# Altium schematic sheet 09 NAND.SchDoc
size 420 x 297 mm
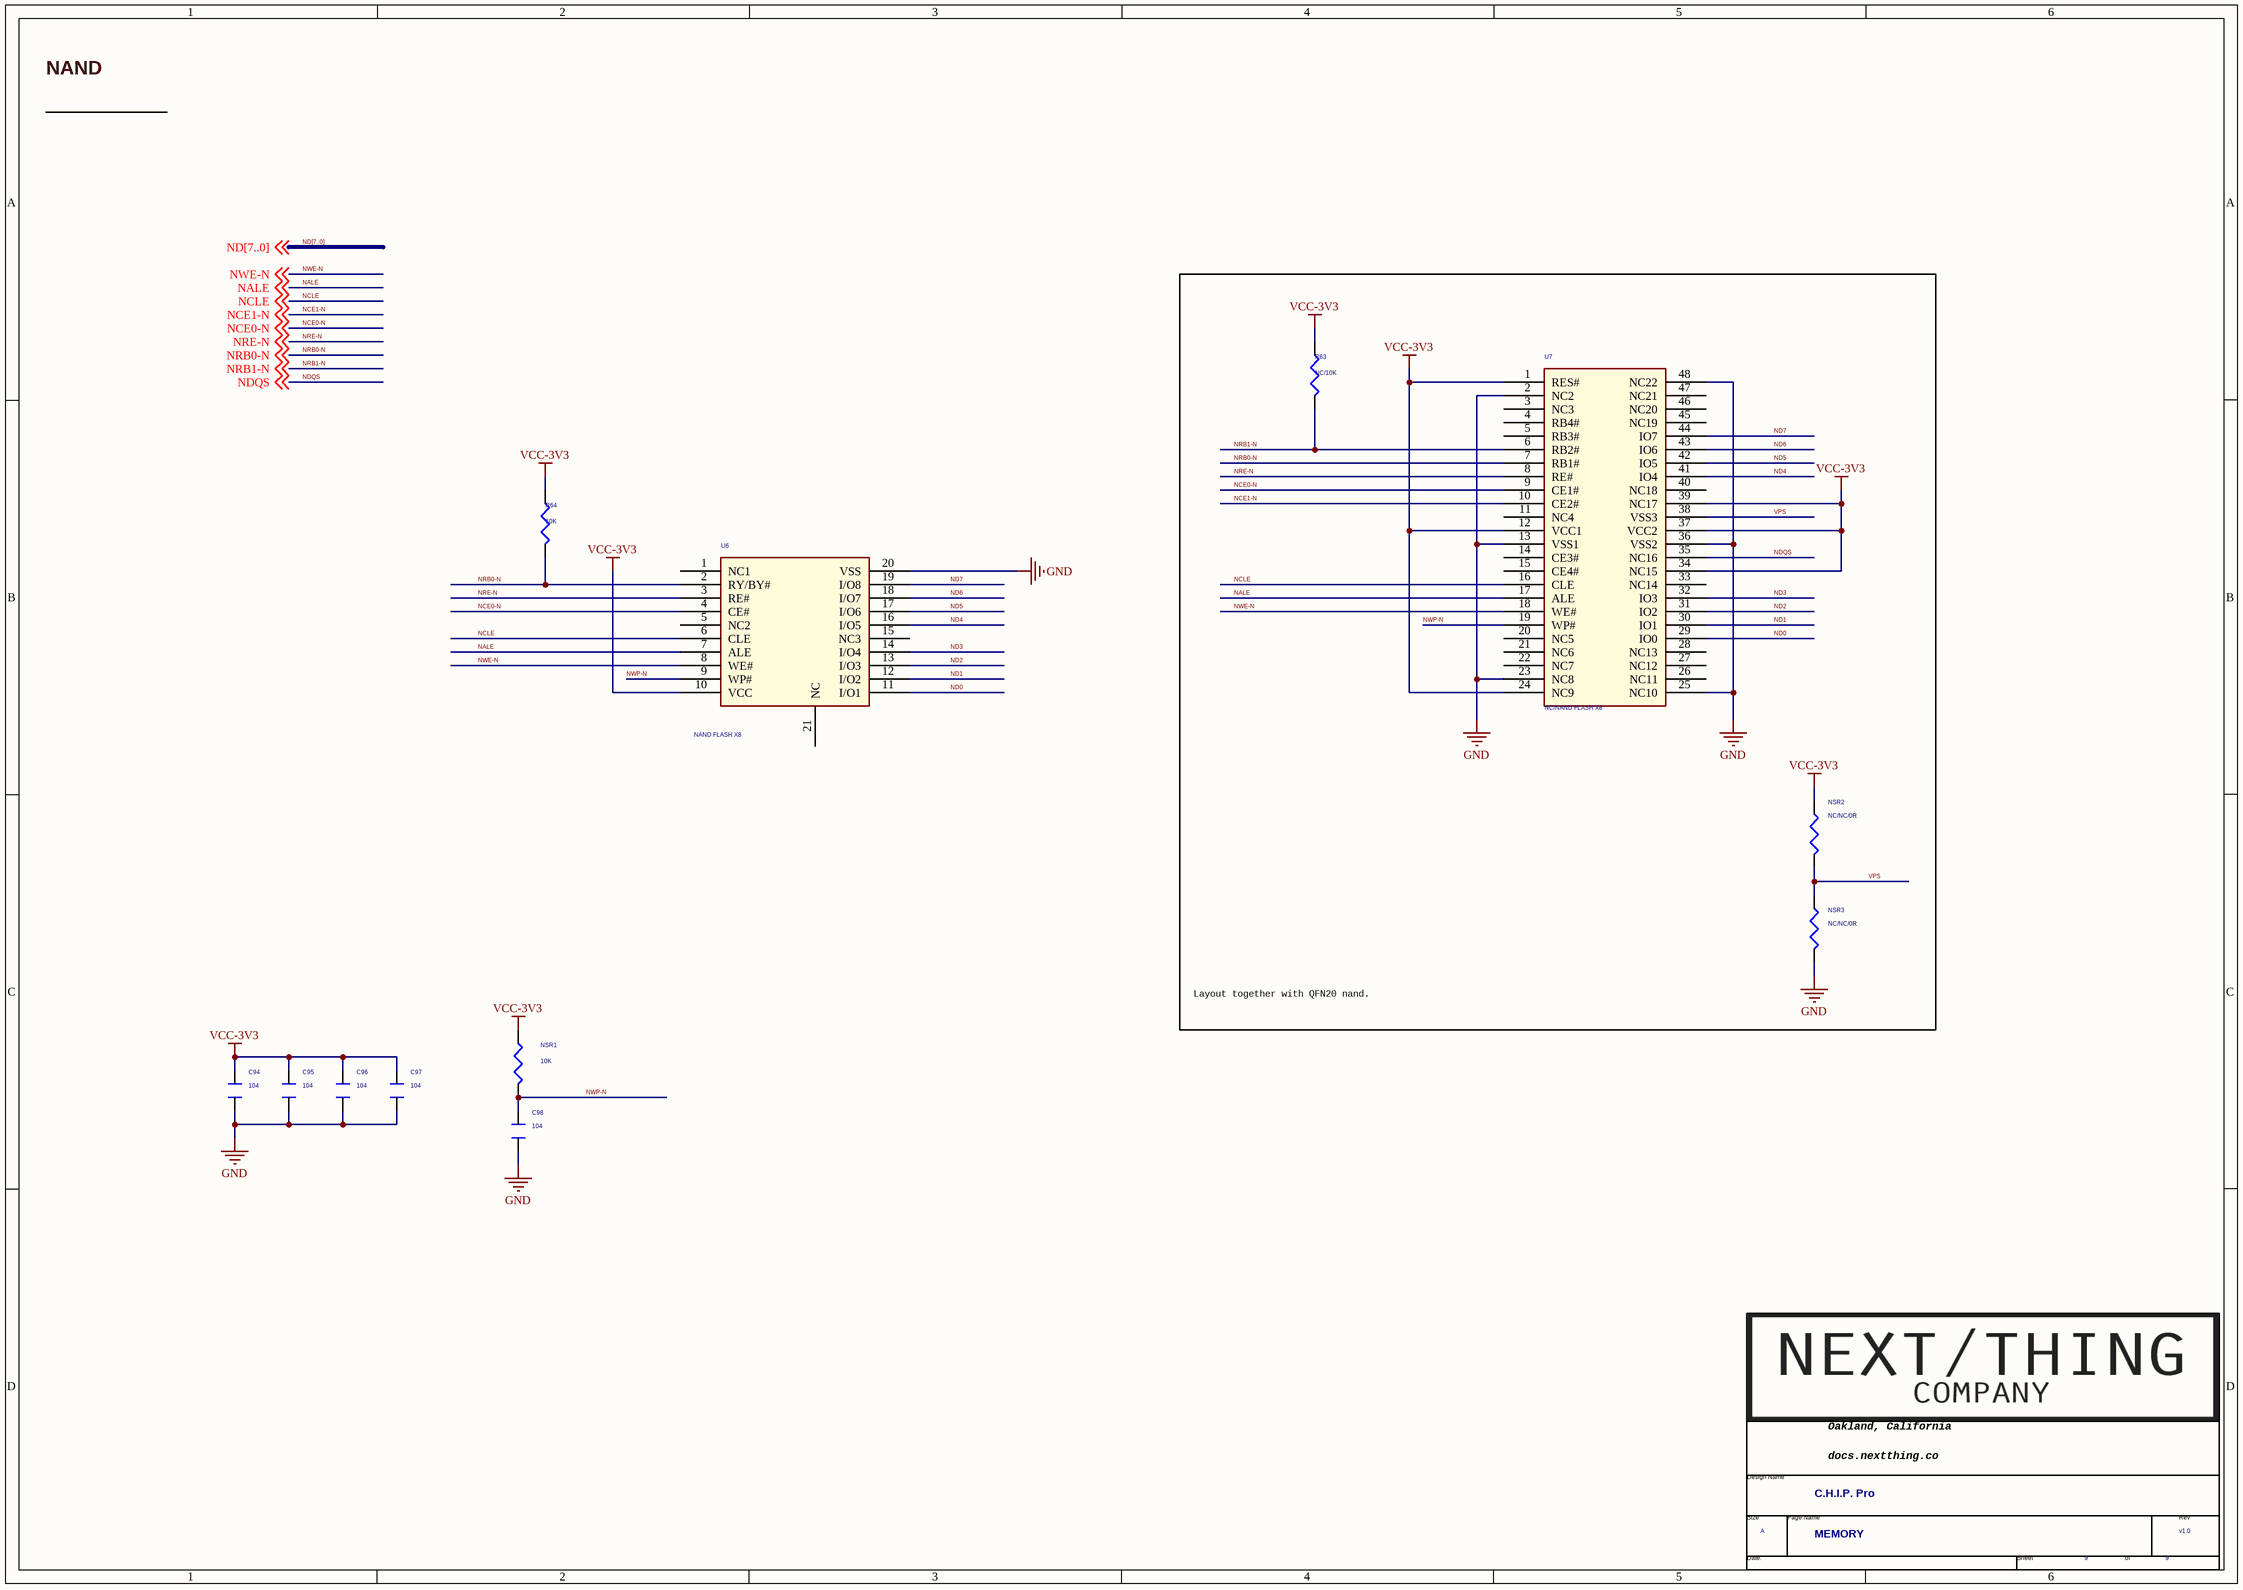
[diagram p0: 09 NAND.SchDoc]

## Parts
*  Page Count: 9  Page Size: A  Title: C.H.I.P. Pro  RevCode: v1.0  Doc: MEMORY  (hidden comment: TitleBlock1-nextthing)  (graphical)
C94  104  [C0201]
C95  104  [C0201]
C96  104  [C0201]
C97  104  [C0201]
C98  104  [C0201]
NSR1  10K  [R0201]
NSR2  NC/NC/0R  [R0201]
NSR3  NC/NC/0R  [R0201]
R63  NC/10K  [R0201]
R64  10K  [R0201]
U6  NAND FLASH X8  [TSOP-48]
U7  NC/NAND FLASH X8  [TSOP-48]

## Blocks framed on the sheet
Layout together with QFN20 nand.: NSR2 NSR3 R63 U7

## Nets
GND: C94.1 C95.1 C96.1 C97.1 C98.1 NSR3.2 U6.20(VSS) U7.2(NC2) U7.13(VSS1) U7.23(NC8) U7.25(NC10) U7.36(VSS2) U7.48(NC22)
VCC-3V3: C94.2 C95.2 C96.2 C97.2 NSR1.1 NSR2.1 R63.1 R64.1 U6.10(VCC) U7.1(RES#) U7.12(VCC1) U7.24(NC9) U7.34(NC15) U7.37(VCC2) U7.39(NC17)
NALE: U6.7(ALE) U7.17(ALE) ; off-sheet NALE
NCE0-N: U6.4(CE#) U7.9(CE1#) ; off-sheet NCE0-N
NCE1-N: U7.10(CE2#) ; off-sheet NCE1-N
NCLE: U6.6(CLE) U7.16(CLE) ; off-sheet NCLE
ND0: U6.11(I/O1) U7.29(IO0)
ND1: U6.12(I/O2) U7.30(IO1)
ND2: U6.13(I/O3) U7.31(IO2)
ND3: U6.14(I/O4) U7.32(IO3)
ND4: U6.16(I/O5) U7.41(IO4)
ND5: U6.17(I/O6) U7.42(IO5)
ND6: U6.18(I/O7) U7.43(IO6)
ND7: U6.19(I/O8) U7.44(IO7)
NDQS: U7.35(NC16) ; off-sheet NDQS
NRB0-N: R64.2 U6.2(RY/BY#) U7.7(RB1#) ; off-sheet NRB0-N
NRB1-N: R63.2 U7.6(RB2#) ; off-sheet NRB1-N
NRE-N: U6.3(RE#) U7.8(RE#) ; off-sheet NRE-N
NWE-N: U6.8(WE#) U7.18(WE#) ; off-sheet NWE-N
NWP-N: C98.2 NSR1.2 U6.9(WP#) U7.19(WP#)
VPS: NSR2.2 NSR3.1 U7.38(VSS3)

Not connected (* = marked no-connect by the designer): U6 1(NC1) 5(NC2) 15(NC3) 21(NC); U7 3(NC3) 4(RB4#) 5(RB3#) 11(NC4) 14(CE3#) 15(CE4#) 20(NC5) 21(NC6) 22(NC7) 26(NC11) 27(NC12) 28(NC13) 33(NC14) 40(NC18) 45(NC19) 46(NC20) 47(NC21)

## Buses and harness runs
bus ND[7..0]

## Notes on the sheet
- NAND
- (in symbol TitleBlock1-nextthing) Oakland, California; Design Name; docs.nextthing.co /; Size; Page Name; Rev; Date:; Sheet; of

## Library data of the parts
C94-C98 = CAPACITOR_0_Dup4: PAGE: 2
NSR1-NSR3 R63 R64 = R_Dup2
  R64: Value: 10K
U6 = NAND_QFN20_1
U7 = NAND_FLASH_X8
* = TitleBlock1-nextthing: Page Number: 9; Page Create Date: March  8, 1995